# EAGLE schematic fu200 (EAGLE 7.6.0)
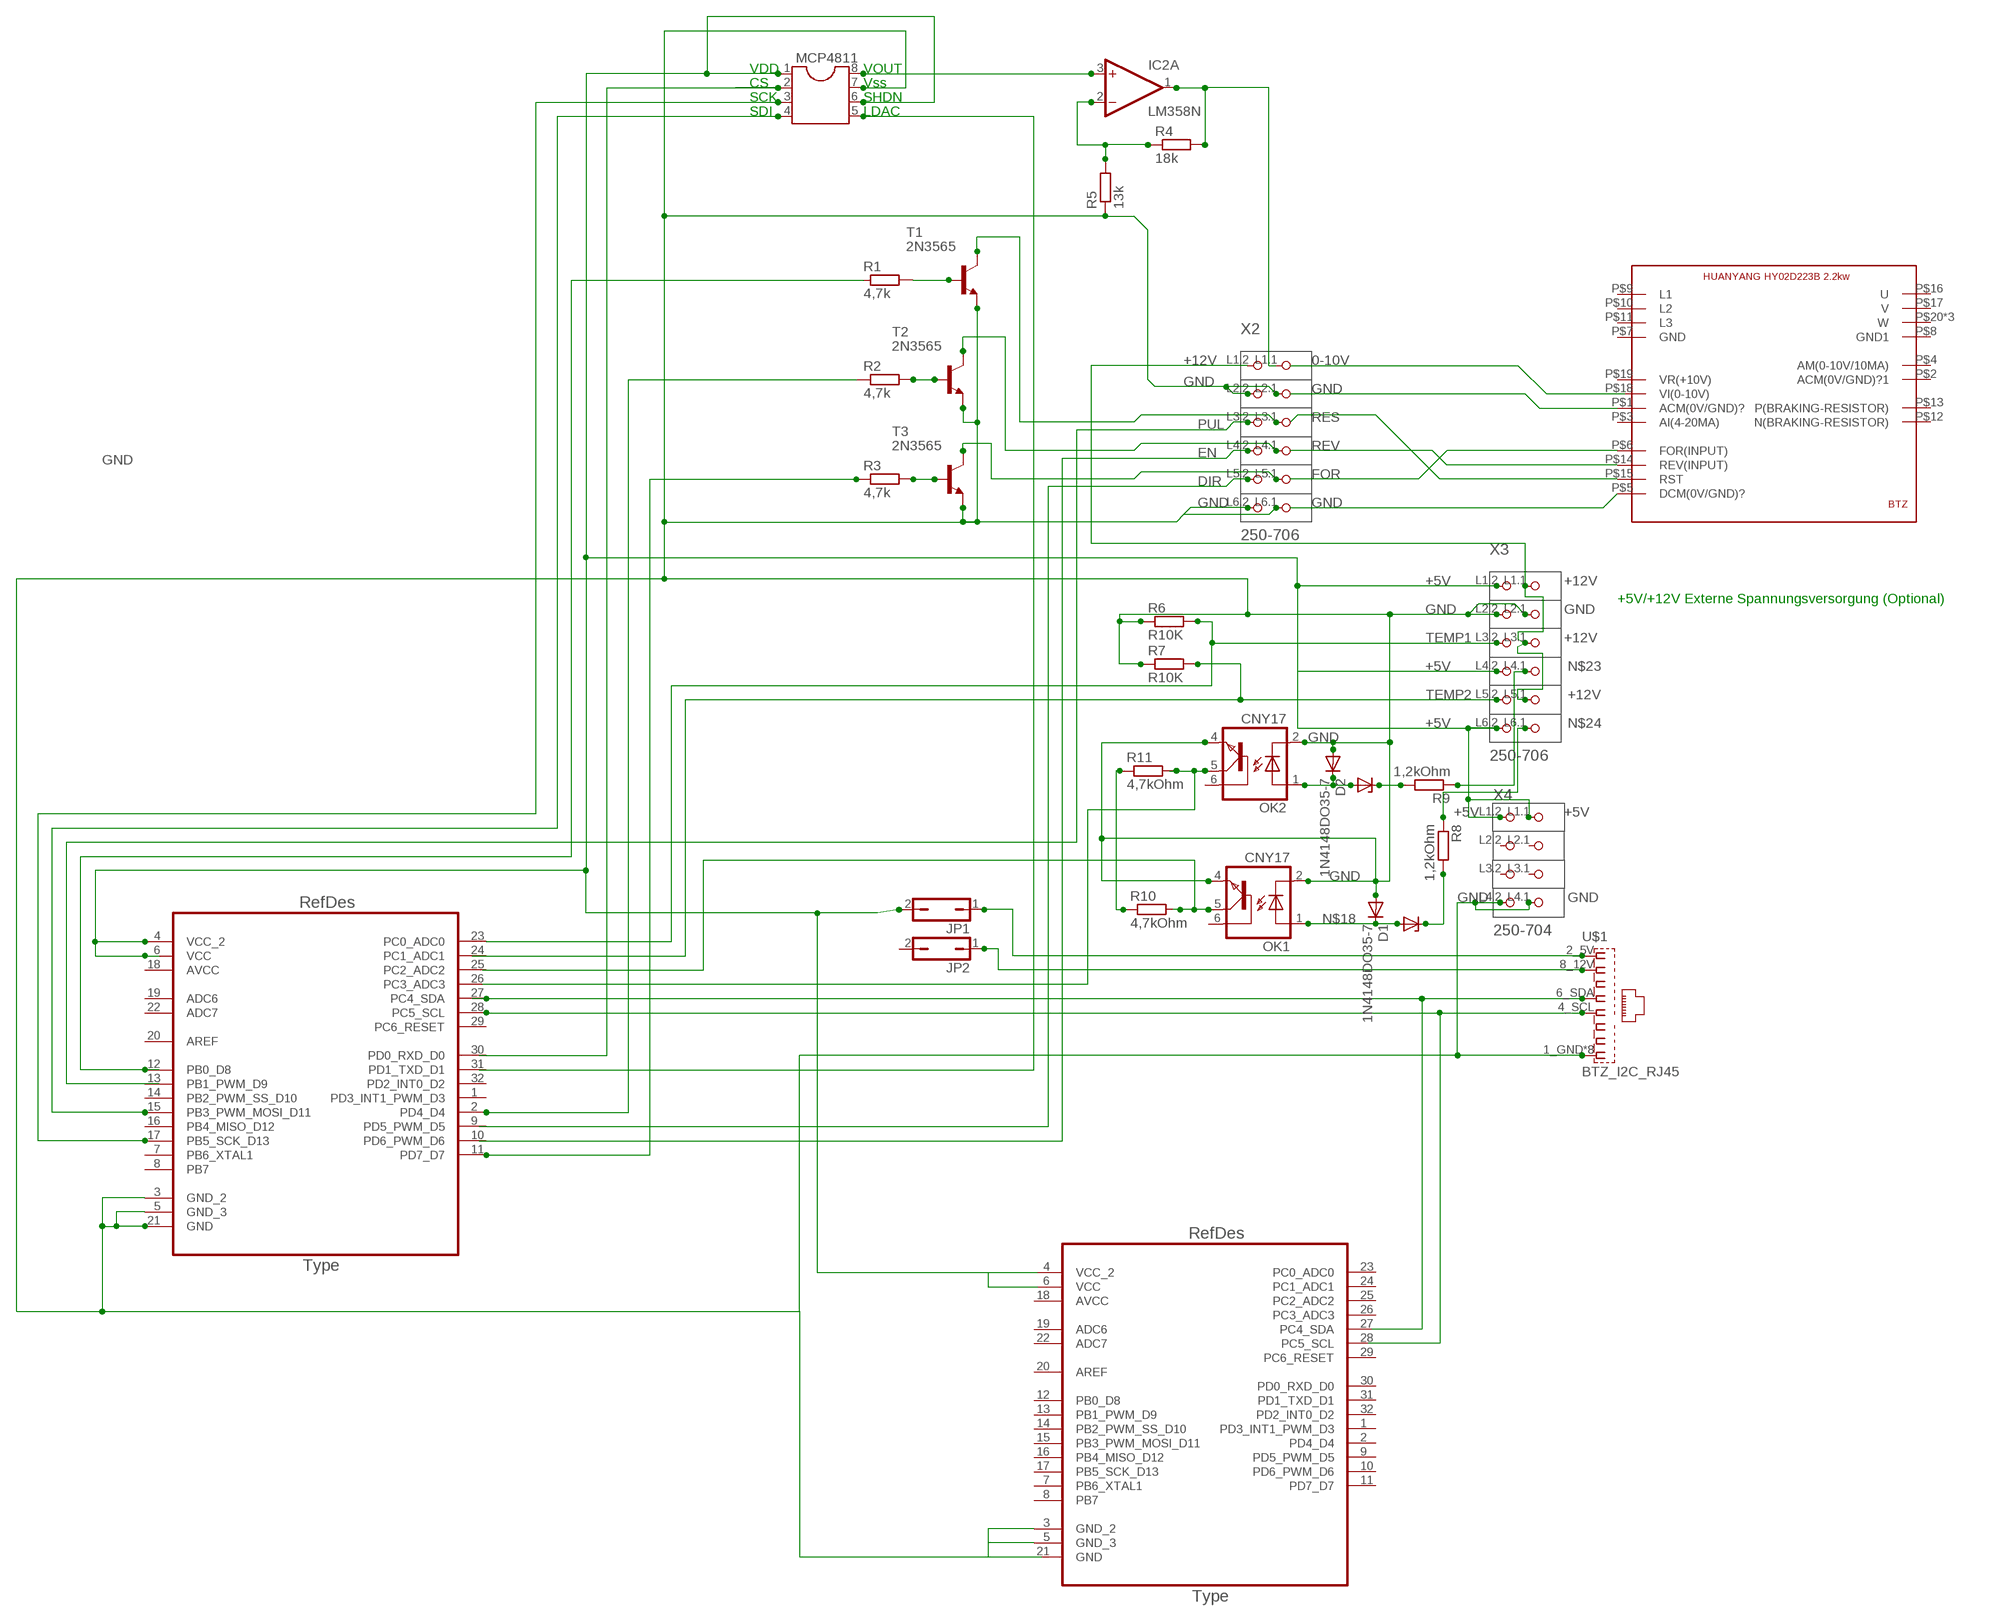
[diagram p0: schematic, sheet 1]

## Parts
D1  1N4148DO35-7  [DO35-7]
D2  1N4148DO35-7  [DO35-7]
IC2  LM358N  [DIL08]
JP1  JP1Q  [JP1]
JP2  JP1Q  [JP1]
MCP4811  DIL8  [DIL08]
OK1  CNY17  [DIL06]
OK2  CNY17  [DIL06]
R1  4,7k  R-EU_0309/10  [0309/10]
R2  4,7k  R-EU_0309/10  [0309/10]
R3  4,7k  R-EU_0309/10  [0309/10]
R4  18k  R-EU_0204/7  [0204/7]
R5  13k  R-EU_0204/7  [0204/7]
R6  R10K  R-EU_0309/10  [0309/10]
R7  R10K  R-EU_0309/10  [0309/10]
R8  1,2kOhm  R-EU_0204/7  [0204/7]
R9  1,2kOhm  R-EU_0204/7  [0204/7]
R10  4,7kOhm  R-EU_0204/7  [0204/7]
R11  4,7kOhm  R-EU_0204/7  [0204/7]
T1  2N3565  [TO92]
T2  2N3565  [TO92]
T3  2N3565  [TO92]
U1  ATMEGA328P-AU  [QFP80P900X900X120-32N]
U2  ATMEGA328P-AU  [QFP80P900X900X120-32N]
U$1  BTZ_I2C_RJ45  [RJ45]
U$2  HUN_FU2  [HUN_FU2]
X2  250-706  [P-250-706]
X3  250-706  [P-250-706]
X4  250-704  [P-250-704]

## Nets
0-10V: IC2.1(A:OUT) R4.2 X2.L1.1(P1.1)
+5V: JP1.2 MCP4811.1 MCP4811.6 U1.4(VCC_2) U1.6(VCC) X3.L1.2(P1.2) X3.L4.2(P4.2) X3.L6.2(P6.2) X4.L1.1(P1.1) X4.L1.2(P1.2)
+12V: X2.L1.2(P1.2) X3.L1.1(P1.1) X3.L3.1(P3.1) X3.L5.1(P5.1)
DIR: X2.L5.2(P5.2)
EN: X2.L4.2(P4.2)
FOR: T3.1(C) X2.L5.1(P5.1)
GND: D1.A D2.A MCP4811.7 OK1.2(C) OK1.4(EMI) OK2.2(C) OK2.4(EMI) R5.1 R6.1 R7.1 T1.3(E) T2.3(E) T3.3(E) U1.3(GND_2) U1.5(GND_3) U1.21(GND) U2.3(GND_2) U2.5(GND_3) U$1.1_GND(GND) U$1.3_GND(GND) U$1.5_GND(GND) U$1.7_GND(GND) U$1.G1(GND) U$1.G2(GND) U$1.G3(GND) U$1.G4(GND) X2.L2.1(P2.1) X2.L2.2(P2.2) X2.L6.1(P6.1) X2.L6.2(P6.2) X3.L2.1(P2.1) X3.L2.2(P2.2) X4.L4.1(P4.1) X4.L4.2(P4.2)
N$1: U1.12(PB0_D8)
N$2: R1.2 T1.2(B)
N$3: U$2.P$5(DCM(0V/GND)?)
N$4: U1.27(PC4_SDA) U$1.6_SDA(SDA)
N$5: R3.2 T3.2(B)
N$6: U1.28(PC5_SCL) U$1.4_SCL(SCL)
N$7: JP2.1 U$1.8_12V(12V)
N$8: U$2.P$15(RST)
N$9: U$2.P$6(FOR(INPUT))
N$10: JP1.1 U$1.2_5V(5V)
N$11: U$2.P$14(REV(INPUT))
N$12: R2.1 U1.2(PD4_D4)
N$13: R8.2
N$15: R3.1 U1.11(PD7_D7)
N$16: R2.2 T2.2(B)
N$17: U$2.P$1(ACM(0V/GND)?)
N$18: D1.C OK1.1(A)
N$19: D2.C OK2.1(A)
N$20: R9.2
N$21: R10.1 R11.1
N$22: OK2.5(COL) R11.2
N$23: R9.1 X3.L4.1(P4.1)
N$24: R8.1 X3.L6.1(P6.1)
N$25: OK1.5(COL) R10.2
N$32: MCP4811.2
N$33: IC2.3(A:+IN) MCP4811.8
N$34: MCP4811.3 U1.17(PB5_SCK_D13)
N$35: MCP4811.4 U1.15(PB3_PWM_MOSI_D11)
N$37: MCP4811.5
N$39: IC2.2(A:-IN) R4.1 R5.2
PUL: X2.L3.2(P3.2)
RES: T1.1(C) X2.L3.1(P3.1)
REV: T2.1(C) X2.L4.1(P4.1)
TEMP1: R6.2 U1.23(PC0_ADC0) X3.L3.2(P3.2)
TEMP2: R7.2 X3.L5.2(P5.2)
Unconnected: IC2.5(B:+IN) IC2.6(B:-IN) IC2.7(B:OUT) JP2.2 OK1.6(BAS) OK2.6(BAS) R1.1 U1.1(PD3_INT1_PWM_D3) U1.7(PB6_XTAL1) U1.8(PB7) U1.9(PD5_PWM_D5) U1.10(PD6_PWM_D6) U1.13(PB1_PWM_D9) U1.14(PB2_PWM_SS_D10) U1.16(PB4_MISO_D12) U1.19(ADC6) U1.20(AREF) U1.22(ADC7) U1.24(PC1_ADC1) U1.25(PC2_ADC2) U1.26(PC3_ADC3) U1.29(PC6_RESET) U1.30(PD0_RXD_D0) U1.31(PD1_TXD_D1) U1.32(PD2_INT0_D2) U2.1(PD3_INT1_PWM_D3) U2.2(PD4_D4) U2.7(PB6_XTAL1) U2.8(PB7) U2.9(PD5_PWM_D5) U2.10(PD6_PWM_D6) U2.11(PD7_D7) U2.12(PB0_D8) U2.13(PB1_PWM_D9) U2.14(PB2_PWM_SS_D10) U2.15(PB3_PWM_MOSI_D11) U2.16(PB4_MISO_D12) U2.17(PB5_SCK_D13) U2.19(ADC6) U2.20(AREF) U2.21(GND) U2.22(ADC7) U2.23(PC0_ADC0) U2.24(PC1_ADC1) U2.25(PC2_ADC2) U2.26(PC3_ADC3) U2.27(PC4_SDA) U2.28(PC5_SCL) U2.29(PC6_RESET) U2.30(PD0_RXD_D0) U2.31(PD1_TXD_D1) U2.32(PD2_INT0_D2) U$2.P$2(ACM(0V/GND)?1) U$2.P$3(AI(4-20MA)) U$2.P$4(AM(0-10V/10MA)) U$2.P$7(GND) U$2.P$8(GND1) U$2.P$9(L1) U$2.P$10(L2) U$2.P$11(L3) U$2.P$12(N(BRAKING-RESISTOR)) U$2.P$13(P(BRAKING-RESISTOR)) U$2.P$16(U) U$2.P$17(V) U$2.P$18(VI(0-10V)) U$2.P$19(VR(+10V)) U$2.P$20(W) U$2.P$21(W) U$2.P$22(W) X4.L2.1(P2.1) X4.L2.2(P2.2) X4.L3.1(P3.1) X4.L3.2(P3.2)

## Notes on the sheet
- VDD | VOUT
- CS | Vss
- SCK | SHDN
- SDI | LDAC
- +5V/+12V Externe Spannungsversorgung (Optional)

## Power pins joined to a net without a drawn wire
AVCC: U1.18(AVCC) U2.18(AVCC)
V+: IC2.8(P:V+)
V-: IC2.4(P:V-)
VCC: U2.6(VCC)
VCC_2: U2.4(VCC_2)

## Library data of the parts
D1 D2 = diode:1N4148: DIODE high speed (Philips)
IC2 = linear:LM358: OP AMP also LM158; LM258; LM2904 Source: http://cache.national.com/ds/LM/LM158.pdf
JP1 JP2 = jumper:JP1Q: JUMPER
MCP4811 = ic-package:DIL8: Dual In Line / Socket
OK1 OK2 = optocoupler:CNY17: SIEMENS OPTO COUPLER; MPN: CNY17-1; OC_FARNELL: 1045399; OC_NEWARK: 05M4044
R1-R11 = resistor:R-EU_: RESISTOR, European symbol
T1-T3 = transistor:2N3565: NPN TRANSISTOR
U1 U2 = Atmel-ATMEGA328P-AU:ATMEGA328P-AU; DESCRIPTION: 8-bit Microcontroller with In-System Programmable Flash; MPN: ATMEGA328P-AU; OC_FARNELL: 1715486; OC_NEWARK: 14R4631; PACKAGE: TQFP-32; SUPPLIER: Atmel
U$1 = Btz:BTZ_I2C_RJ45
U$2 = Btz:HUN_FU2
X2 X3 = con-wago_250:250-706: Serie 250, Doppelstock-Klemmenleiste für Leiterplatten 2 Lötstifte/Pol in Reihe / Series 250, Double-deck PCB terminal strip 2 solder pins/pole, in line Polzahl / Pole No.: 6 Rastermaß / Pitch: 5 - 5 mm Bemessungsspannung / Rated Voltage: 320 V Nennstrom / Nominal Current: 10 A Leiterquerschnitt / Conductor Size: 0.5 - 1.5 mm2 Anschlusstechnik / Connection Technology: CAGE CLAMP® S Lötstiftlänge: / Solder Pin Length: 4 mm Leitereinführung (zur Platine) / Conductor entry angle (to PCB): 45 ° Farbe / Color: grau / gray Stand: 01.01.2014. Die jeweils aktuellen Daten zu diesem Artikel finden Sie in unserem Produktkatalog, den Sie unter www.wago.com einsehen können. As of: 01/01/2014. Please find the newest data for this article in our product catalogue, which can be viewed under www.wago.com.
X4 = con-wago_250:250-704: Serie 250, Doppelstock-Klemmenleiste für Leiterplatten 2 Lötstifte/Pol in Reihe / Series 250, Double-deck PCB terminal strip 2 solder pins/pole, in line Polzahl / Pole No.: 4 Rastermaß / Pitch: 5 - 5 mm Bemessungsspannung / Rated Voltage: 320 V Nennstrom / Nominal Current: 10 A Leiterquerschnitt / Conductor Size: 0.5 - 1.5 mm2 Anschlusstechnik / Connection Technology: CAGE CLAMP® S Lötstiftlänge: / Solder Pin Length: 4 mm Leitereinführung (zur Platine) / Conductor entry angle (to PCB): 45 ° Farbe / Color: grau / gray Stand: 01.01.2014. Die jeweils aktuellen Daten zu diesem Artikel finden Sie in unserem Produktkatalog, den Sie unter www.wago.com einsehen können. As of: 01/01/2014. Please find the newest data for this article in our product catalogue, which can be viewed under www.wago.com.